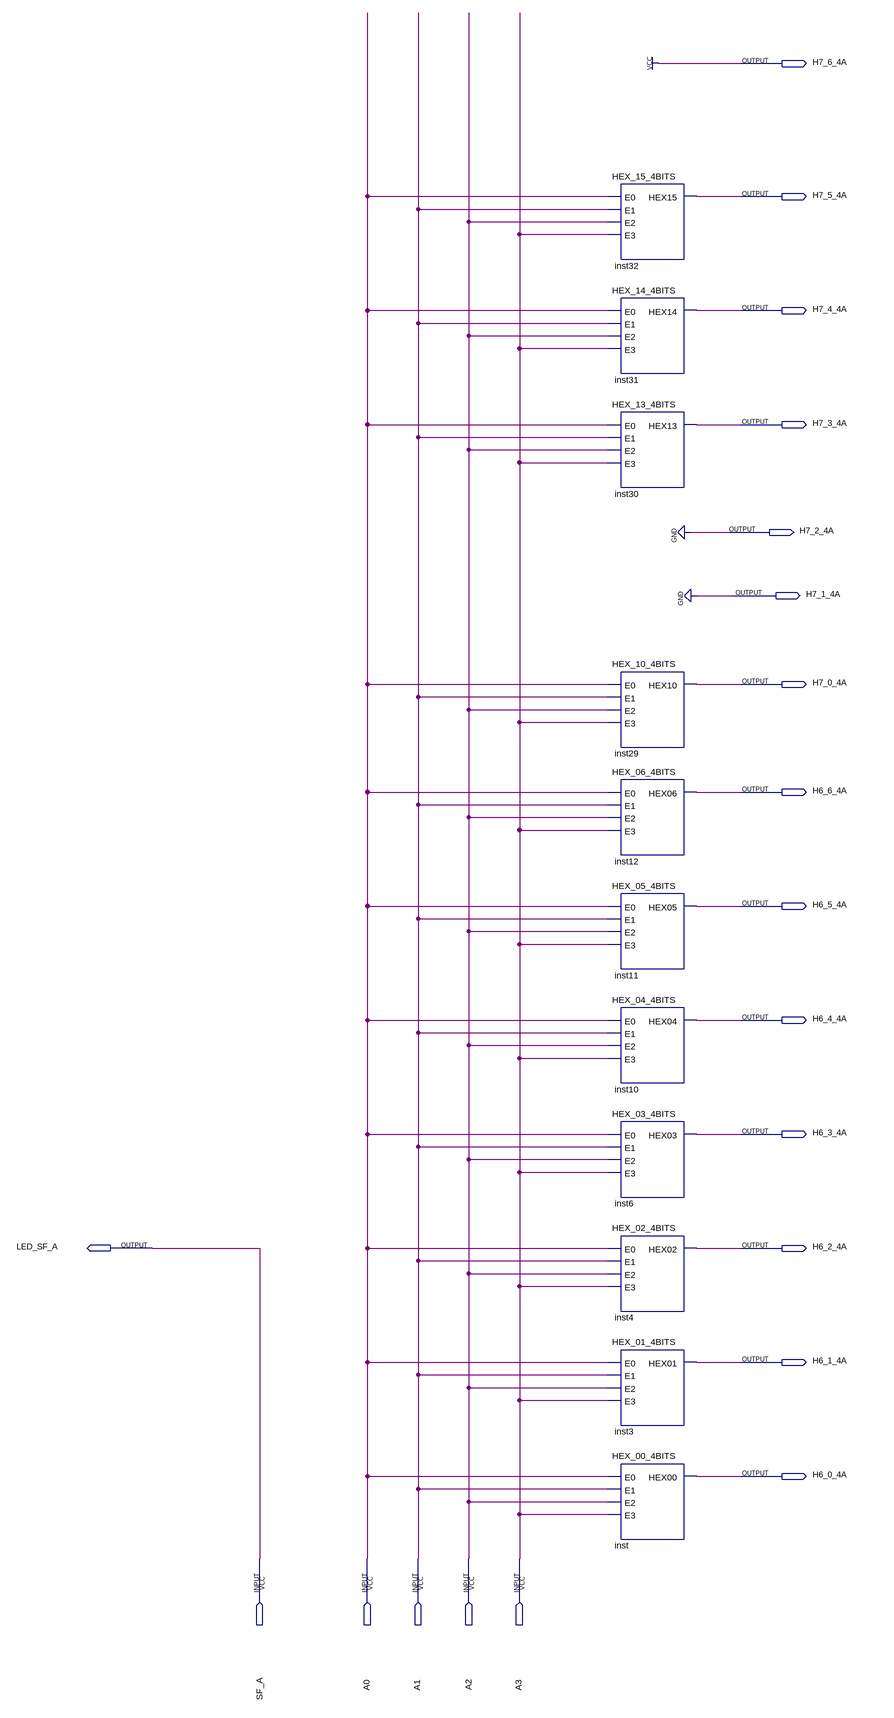
[diagram p0: schematic sheet]
// Quartus schematic decodificador_7_segmentos_A.bdf as structural Verilog: 11 symbols, 20 pins
module decodificador_7_segmentos_A (
  input  SF_A,
  input  A0,
  input  A1,
  input  A2,
  input  A3,
  output H7_6_4A,
  output H7_5_4A,
  output H7_4_4A,
  output H7_3_4A,
  output H7_2_4A,
  output H7_1_4A,
  output H7_0_4A,
  output H6_6_4A,
  output H6_5_4A,
  output H6_4_4A,
  output H6_3_4A,
  output LED_SF_A,
  output H6_2_4A,
  output H6_1_4A,
  output H6_0_4A
);

  HEX_15_4BITS inst32 (.E0(A0), .E1(A1), .E2(A2), .E3(A3), .HEX15(H7_5_4A));
  HEX_14_4BITS inst31 (.E0(A0), .E1(A1), .E2(A2), .E3(A3), .HEX14(H7_4_4A));
  HEX_13_4BITS inst30 (.E0(A0), .E1(A1), .E2(A2), .E3(A3), .HEX13(H7_3_4A));
  HEX_10_4BITS inst29 (.E0(A0), .E1(A1), .E2(A2), .E3(A3), .HEX10(H7_0_4A));
  HEX_06_4BITS inst12 (.E0(A0), .E1(A1), .E2(A2), .E3(A3), .HEX06(H6_6_4A));
  HEX_05_4BITS inst11 (.E0(A0), .E1(A1), .E2(A2), .E3(A3), .HEX05(H6_5_4A));
  HEX_04_4BITS inst10 (.E0(A0), .E1(A1), .E2(A2), .E3(A3), .HEX04(H6_4_4A));
  HEX_03_4BITS inst6 (.E0(A0), .E1(A1), .E2(A2), .E3(A3), .HEX03(H6_3_4A));
  HEX_02_4BITS inst4 (.E0(A0), .E1(A1), .E2(A2), .E3(A3), .HEX02(H6_2_4A));
  HEX_01_4BITS inst3 (.E0(A0), .E1(A1), .E2(A2), .E3(A3), .HEX01(H6_1_4A));
  HEX_00_4BITS inst (.E0(A0), .E1(A1), .E2(A2), .E3(A3), .HEX00(H6_0_4A));

  assign H7_1_4A = 1'b0;
  assign H7_2_4A = 1'b0;
  assign H7_6_4A = 1'b1;
  assign LED_SF_A = SF_A;
endmodule
